# EAGLE design AG1170 Breakout (EAGLE 7.0.0)
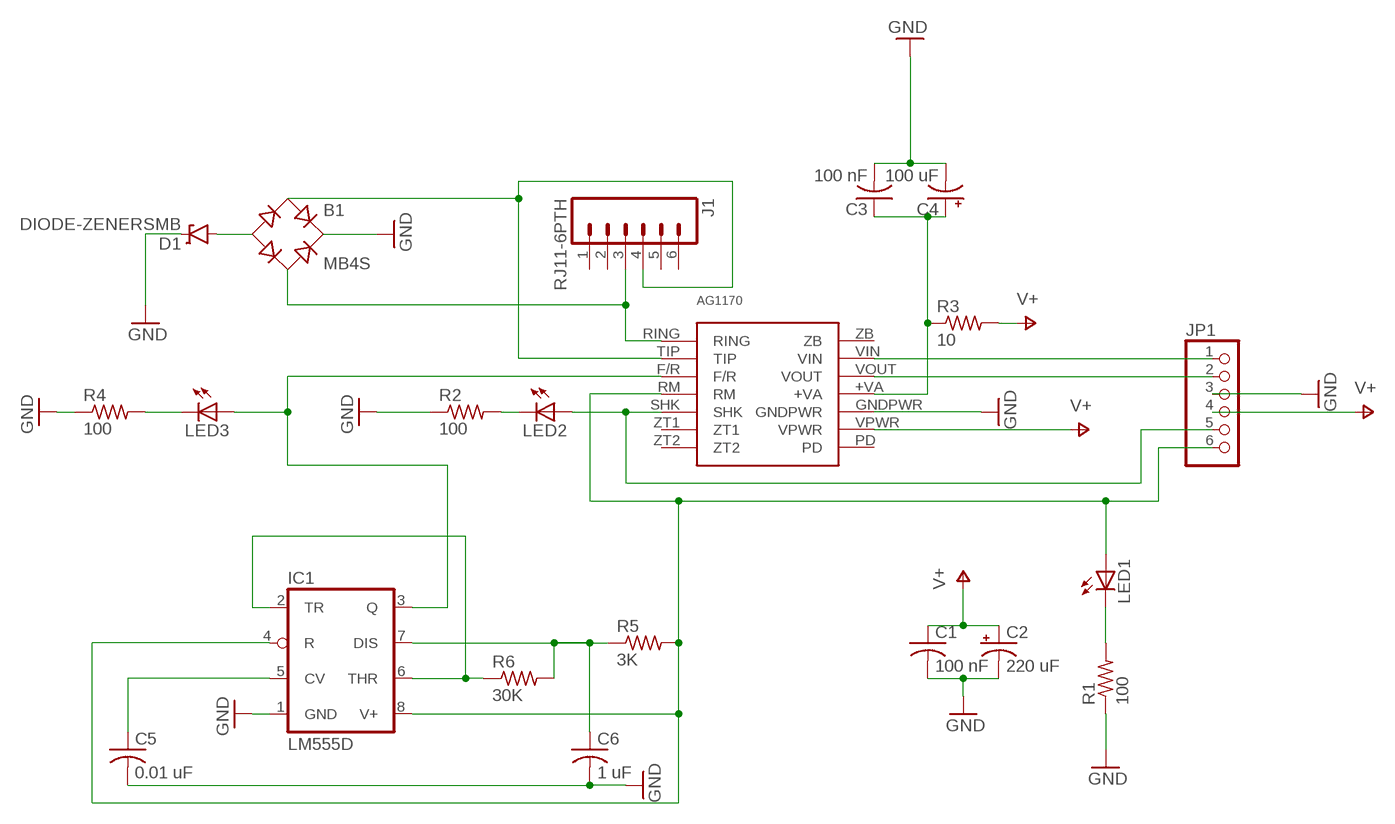
[diagram p0: schematic, sheet 1]

## Parts
AG1170  AG1170  [AG1170]
B1  MB4S  [SOIC-4]
C1  100 nF  C-USC0805  [C0805]
C2  220 uF  CAP_POL1206  [EIA3216]
C3  100 nF  C-USC0805  [C0805]
C4  100 uF  CAP_POL1206  [EIA3216]
C5  0.01 uF  C-USC0805  [C0805]
C6  1 uF  C-USC0805  [C0805]
D1  DIODE-ZENERSMB  [SMB-DIODE]
IC1  LM555D  [SO08]
J1  RJ11-6PTH  [RJ11-6]
JP1  PINHD-1X6  [1X06]
LED1  LEDCHIP-LED0805  [CHIP-LED0805]
LED2  LEDCHIP-LED0805  [CHIP-LED0805]
LED3  LEDCHIP-LED0805  [CHIP-LED0805]
R1  100  R-US_R0805  [R0805]
R2  100  R-US_R0805  [R0805]
R3  10  R-US_R0805  [R0805]
R4  100  R-US_R0805  [R0805]
R5  3K  R-US_R0805  [R0805]
R6  30K  R-US_R0805  [R0805]

## Nets
GND: AG1170.GNDPWR B1.+ C1.2 C2.C(-) C3.2 C4.C(-) C5.2 C6.2 D1.C IC1.1(GND) JP1.3 R1.1 R2.1 R4.1
N$1: LED1.C R1.2
N$2: LED2.C R2.2
N$3: AG1170.SHK JP1.5 LED2.A
N$4: AG1170.+VA C3.1 C4.A(+) R3.1
N$5: LED3.C R4.2
N$6: AG1170.RM IC1.4(R) IC1.8(V+) JP1.6 LED1.A R5.2
N$7: AG1170.VIN JP1.1
N$8: AG1170.VOUT JP1.2
N$9: AG1170.RING B1.~2(AC2) J1.3
N$10: AG1170.TIP B1.~1(AC1) J1.4
N$11: AG1170.F/R IC1.3(Q) LED3.A
N$12: B1.- D1.A
N$13: IC1.2(TR) IC1.6(THR) R6.1
N$14: C6.1 IC1.7(DIS) R5.1 R6.2
N$15: C5.1 IC1.5(CV)
V+: AG1170.VPWR C1.1 C2.A(+) JP1.4 R3.2
Unconnected: AG1170.PD AG1170.ZB AG1170.ZT1 AG1170.ZT2 J1.1 J1.2 J1.5 J1.6

## Library data of the parts
AG1170 = Pink & Black:AG1170
B1 = rectifier:MB*S: Bridge Rectifier Source: http://www.fairchildsemi.com/ds/MB/MB6S.pdf
C1 C3 C5 C6 = adafruit:C-US: CAPACITOR, American symbol
C2 C4 = SparkFun-Capacitors:CAP_POL: Capacitor Polarized These are standard SMD and PTH capacitors. Normally 10uF, 47uF, and 100uF in electrolytic and tantalum varieties. Always verify the external diameter of the through hole cap, it varies with capacity, voltage, and manufacturer. The EIA devices should be standard.
D1 = SparkFun-DiscreteSemi:DIODE-ZENER: Zener Diode Production Part - 8199 3.4V Zener Voltage
IC1 = adafruit:*555: TIMER Changed DIP package to have round (not oval) pin pads http://www.ladyada.net/library/pcb/eaglelibrary.html
J1 = SparkFun-Connectors:RJ11-6: RJ11 Jack Simple 6 pin RJ11 jack. Commonly found on CAT3 devices and Microchip programmers. SKU: PRT-00132
JP1 = adafruit:PINHD-1X6: PIN HEADER
LED1-LED3 = adafruit:LED: LED OSRAM: - CHIPLED LG R971, LG N971, LY N971, LG Q971, LY Q971, LO R971, LY R971 LH N974, LH R974 LS Q976, LO Q976, LY Q976 LO Q996 - Hyper CHIPLED LW Q18S LB Q993, LB Q99A, LB R99A - SideLED LS A670, LO A670, LY A670, LG A670, LP A670 LB A673, LV A673, LT A673, LW A673 LH A674 LY A675 LS A676, LA A676, LO A676, LY A676, LW A676 LS A679, LY A679, LG A679 - Hyper Micro SIDELED® LS Y876, LA Y876, LO Y876, LY Y876 LT Y87S - SmartLED LW L88C, LW L88S LB L89C, LB L89S, LG L890 LS L89K, LO L89K, LY L89K LS L896, LA L896, LO L896, LY L896 - TOPLED LS T670, LO T670, LY T670, LG T670, LP T670 LSG T670, LSP T670, LSY T670, LOP T670, LYG T670 LG T671, LOG T671, LSG T671 LB T673, LV T673, LT T673, LW T673 LH T674 LS T676, LA T676, LO T676, LY T676, LB T676, LH T676, LSB T676, LW T676 LB T67C, LV T67C, LT T67C, LS T67K, LO T67K, LY T67K, LW E67C LS E67B, LA E67B, LO E67B, LY E67B, LB E67C, LV E67C, LT E67C LW T67C LS T679, LY T679, LG T679 LS T770, LO T770, LY T770, LG T770, LP T770 LB T773, LV T773, LT T773, LW T773 LH T774 LS E675, LA E675, LY E675, LS T675 LS T776, LA T776, LO T776, LY T776, LB T776 LHGB T686 LT T68C, LB T68C - Hyper Mini TOPLED® LB M676 - Mini TOPLED Santana® LG M470 LS M47K, LO M47K, LY M47K Source: http://www.osram.convergy.de/
R1-R6 = adafruit:R-US_: RESISTOR, American symbol

## Net classes
0 default: width 0.305 mm, drill 0.508 mm, clearance 0.254 mm

## Board
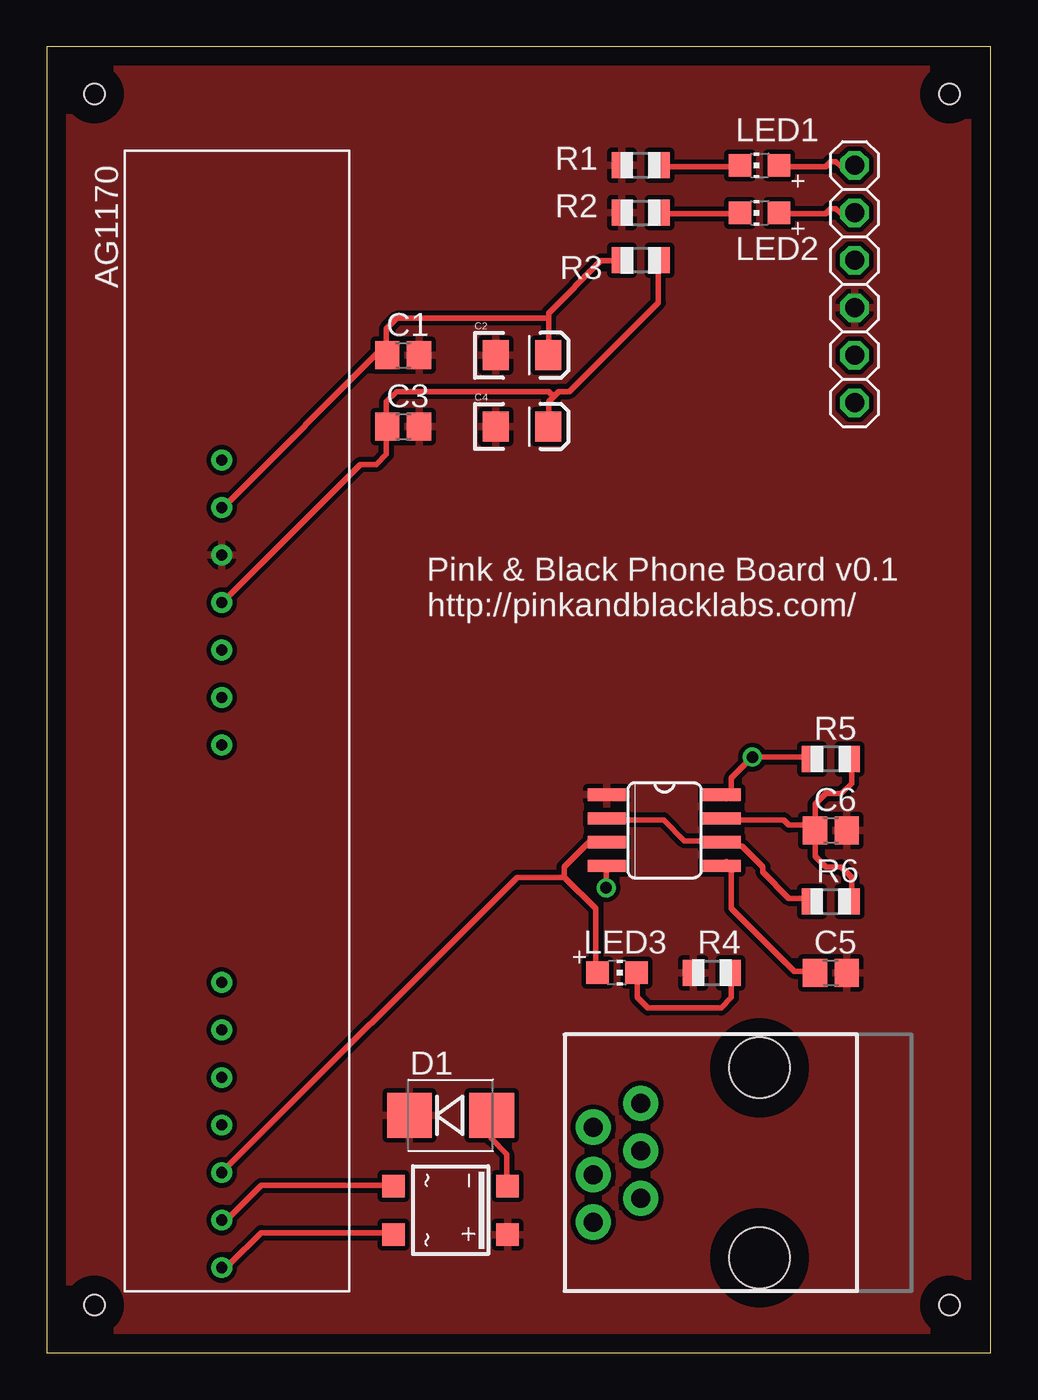
[diagram p1: board, top side]
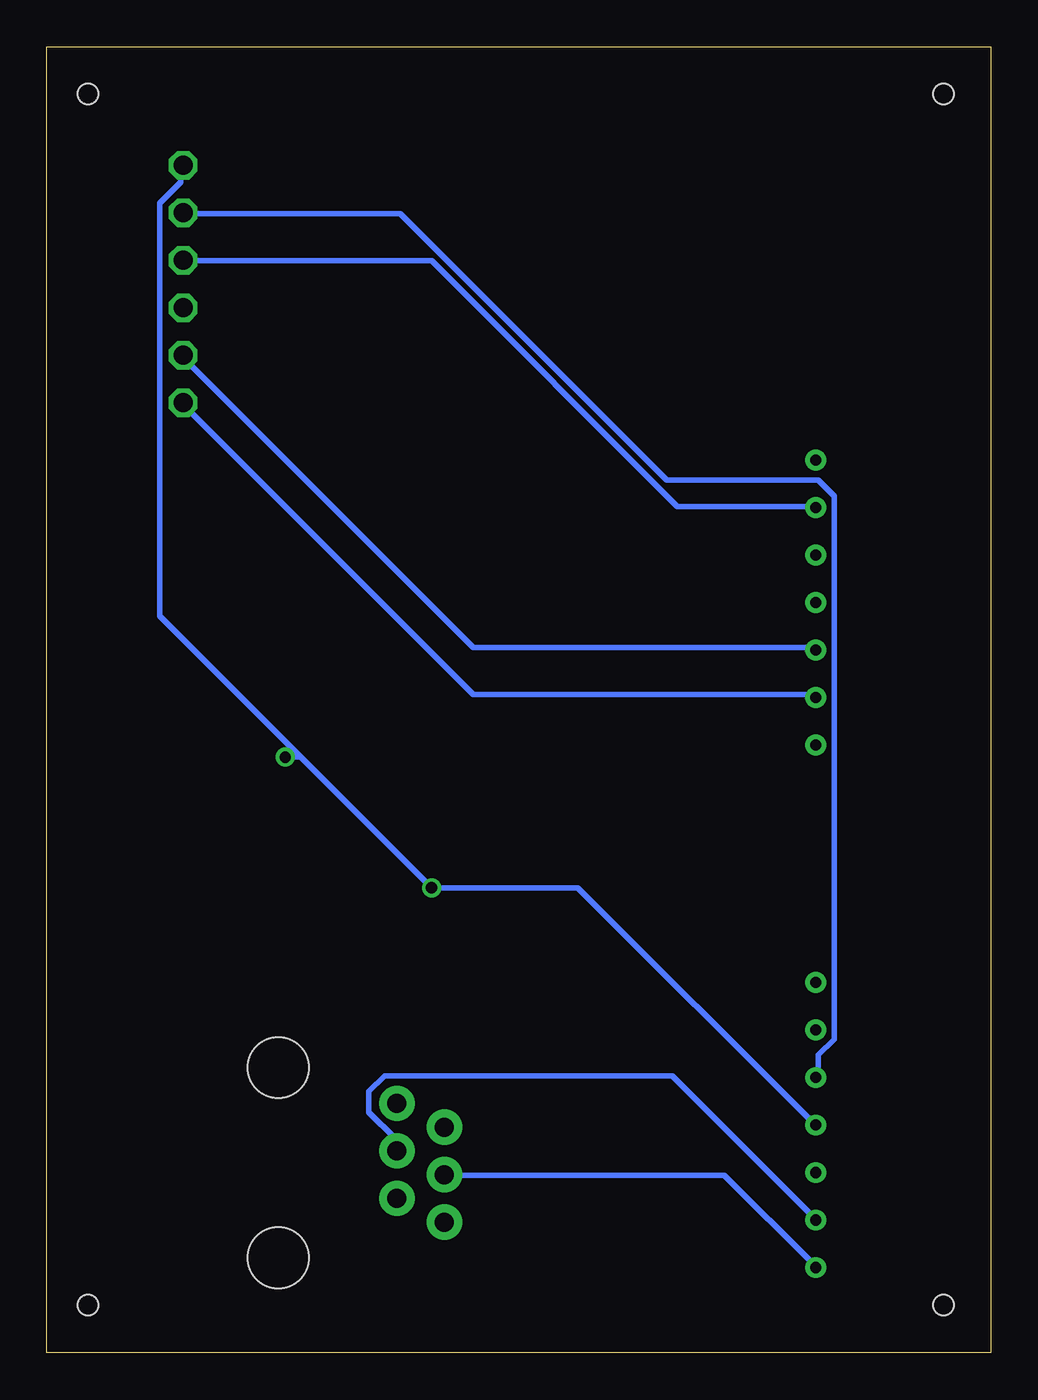
[diagram p2: board, bottom side, seen from below]

Size 50.47 x 69.84 mm. Coordinates in mm from the lower left corner, seen from the top.
Outline: 0,0 50.47,0 50.47,69.84 0,69.84 0,0
Copper layers (1*16): Top 0.035mm / dielectric 1.5mm / Bottom 0.035mm
Design rules "default *": minimum track width 10mil, minimum drill 20mil, track to track 8mil, track to pad 8mil, pad to pad 8mil, via to via 8mil, smd to smd 8mil, copper to edge 40mil, drill to drill 8mil, minimum pad ring 10mil, minimum via ring 8mil, stop-mask expansion 4mil, vias tented up to drill 0mil, thermal gap 10mil
Holes 1.1 mm at 2.54,2.54 48.26,2.54 48.26,67.31 2.54,67.31

### Footprints (pad centres in the part's own frame; a part is rotated, then mirrored left to right if it is on the bottom)
AG1170 = drill 0.6: +VA -5.83,-0.8; F/R 24.65,-0.8; GNDPWR -8.37,-0.8; PD -13.45,-0.8; RING 29.73,-0.8; RM 22.11,-0.8; SHK 19.57,-0.8; TIP 27.19,-0.8; VIN -0.75,-0.8; VOUT -3.29,-0.8; VPWR -10.91,-0.8; ZB 1.79,-0.8; ZT1 17.03,-0.8; ZT2 14.49,-0.8
SOIC-4 = smd 1.2 x 1.2: + 1.3,3.05; - -1.3,3.05; ~1 -1.3,-3.05; ~2 1.3,-3.05
C0805 = smd 1.3 x 1.5: 1 -0.85,0; 2 0.85,0
EIA3216 = smd 1.4 x 1.6: A 1.4,0; C -1.4,0
SMB-DIODE = smd 2.4 x 2.4: A 2.2,0; C -2.2,0
SO08 = smd 0.66 x 2.032: 1 -1.905,-3.073; 2 -0.635,-3.073; 3 0.635,-3.073; 4 1.905,-3.073; 5 1.905,3.073; 6 0.635,3.073; 7 -0.635,3.073; 8 -1.905,3.073
RJ11-6 = drill 1.016 pad 1.88: 1 1.905,8.89; 2 3.175,6.35; 3 4.445,8.89; 4 5.715,6.35; 5 6.985,8.89; 6 8.255,6.35 | hole 3.251: 0,0; 10.16,0
1X06 = drill 1.016 octagon: 1 -6.35,0; 2 -3.81,0; 3 -1.27,0; 4 1.27,0; 5 3.81,0; 6 6.35,0
CHIP-LED0805 = smd 1.2 x 1.2: A 0,-1.05; C 0,1.05
R0805 = smd 1.1 x 1.4: 1 -1,0; 2 1,0

### Placement (x,y rotation side)
AG1170  10.16,34.29 270 top
B1  21.59,7.62 270 top
C1  19.05,53.34 0 top
C2  25.4,53.34 0 top
C3  19.05,49.53 0 top
C4  25.4,49.53 0 top
C5  41.91,20.32 0 top
C6  41.91,27.94 0 top
D1  21.59,12.7 0 top
IC1  33.02,27.94 270 top
J1  38.1,5.08 90 top
JP1  43.18,57.15 90 top
LED1  38.1,63.5 90 top
LED2  38.1,60.96 90 top
LED3  30.48,20.32 270 top
R1  31.75,63.5 0 top
R2  31.75,60.96 0 top
R3  31.75,58.42 180 top
R4  35.56,20.32 0 top
R5  41.91,31.75 180 top
R6  41.91,24.13 0 top

### Tracks (layer width: path | path; a pad name or v marks a point on that pad's centre or on a via)
GND
  pour Top: -1.27,-1.27 59.69,-1.27 59.69,71.12 -1.27,71.12
N$1
  Top 0.305: LED1.C 36.88,63.42 32.97,63.42 R1.2
N$2
  Top 0.305: LED2.C 36.88,60.91 32.97,60.91 R2.2
N$3
  Top 0.305: LED2.A 39.4,60.91 41.63,60.91 41.91,61.19 42.19,61.19 42.47,60.91 43.03,60.91 JP1.5
  Bottom 0.305: AG1170.SHK 9.22,14.81 9.22,15.93 8.38,16.76 8.38,45.82 9.22,46.66 17.32,46.66 31.57,60.91 43.03,60.91 JP1.5
N$4
  Top 0.305: 27.1,51.13 26.82,50.85 26.82,49.73 C4.A | 27.1,51.13 27.38,51.41 27.94,51.41 32.69,56.16 32.69,58.4 R3.1 | 27.1,51.13 26.82,51.41 18.72,51.41 18.16,50.85 18.16,49.73 C3.1 18.16,49.45 18.16,48.06 17.6,47.5 16.76,47.5 9.5,40.23 AG1170.+VA
N$5
  Top 0.305: LED3.C 31.57,20.12 31.57,19 32.13,18.44 36.04,18.44 36.6,19 36.6,20.12 R4.2
N$6  (via drill 0.61)
  Top 0.305: R5.2 40.79,31.85 v37.72,31.85 36.6,30.73 36.6,29.9 36.32,29.62 IC1.8 | LED1.A 39.4,63.42 41.63,63.42 41.91,63.7 42.19,63.7 42.47,63.42 43.03,63.42 JP1.6 | v29.9,24.87 29.9,25.98 IC1.4
  Bottom 0.305: AG1170.RM 9.5,12.29 22.07,24.87 v29.9,24.87 36.88,31.85 | 36.88,31.85 44.42,39.4 44.42,61.47 43.31,62.59 43.31,63.42 JP1.6 | 36.88,31.85 v37.72,31.85
N$7
  Bottom 0.305: AG1170.VIN 9.5,35.2 27.66,35.2 43.03,50.57 JP1.1
N$8
  Bottom 0.305: AG1170.VOUT 9.5,37.72 27.66,37.72 43.03,53.09 JP1.2
N$9
  Top 0.305: B1.~2 18.44,6.43 11.46,6.43 9.78,4.75 9.78,4.47 9.5,4.19 9.22,4.47 AG1170.RING
  Bottom 0.305: J1.3 29.06,9.5 14.25,9.5 9.5,4.75 AG1170.RING
N$10
  Top 0.305: B1.~1 18.44,8.94 11.46,8.94 9.5,6.99 AG1170.TIP
  Bottom 0.305: J1.4 31.85,10.9 31.85,11.46 33.25,12.85 33.25,13.97 32.41,14.81 17.04,14.81 9.5,7.26 AG1170.TIP
N$11
  Top 0.305: 27.66,25.43 29.34,23.75 29.34,20.4 LED3.A | 27.66,25.43 27.66,25.98 29.06,27.38 29.9,27.38 IC1.3 | 27.66,25.43 25.15,25.43 9.5,9.78 AG1170.F/R
N$12
  Top 0.305: B1.- 24.59,8.94 24.59,10.62 23.75,11.46 23.75,12.57 D1.A
N$13
  Top 0.305: R6.1 40.79,24.31 39.67,24.31 38.28,25.7 38.28,25.98 37.16,27.1 36.32,27.1 IC1.6 36.04,27.38 34.09,27.38 32.97,28.5 30.18,28.5 IC1.2
N$14
  Top 0.305: 41.07,27.94 41.07,26.54 41.63,25.98 42.47,25.98 43.03,25.43 43.03,24.31 R6.2 | 41.07,27.94 41.07,28.22 | 41.07,28.22 41.07,29.34 41.63,29.9 42.47,29.9 43.03,30.45 43.03,31.57 R5.1 | 41.07,27.94 C6.1 41.07,28.22 | 41.07,28.22 39.67,28.22 39.4,28.5 36.32,28.5 IC1.7
N$15
  Top 0.305: C5.1 40.79,20.4 39.95,20.4 36.6,23.75 36.6,25.98 36.32,26.26 IC1.5
V+
  Top 0.305: 26.82,55.32 26.82,53.37 C2.A | 26.82,55.32 26.82,55.6 29.62,58.4 30.73,58.4 R3.2 | 18.16,53.92 18.16,54.76 18.72,55.32 26.82,55.32 | 18.16,53.92 18.16,53.37 C1.1 18.16,53.92 | 18.16,53.92 9.5,45.26 AG1170.VPWR
  Bottom 0.305: JP1.4 43.03,58.4 29.9,58.4 16.76,45.26 9.5,45.26 AG1170.VPWR

### Text on the board
tPlace: Pink & Black Phone Board v0.1 / http://pinkandblacklabs.com/